# EAGLE schematic EEZ DIB MCU r2B1 (EAGLE 7.2.0)
Assembly variants: Farnell, TME

## Sheet 1 of 5: I/O connectors, Encoder, user SW
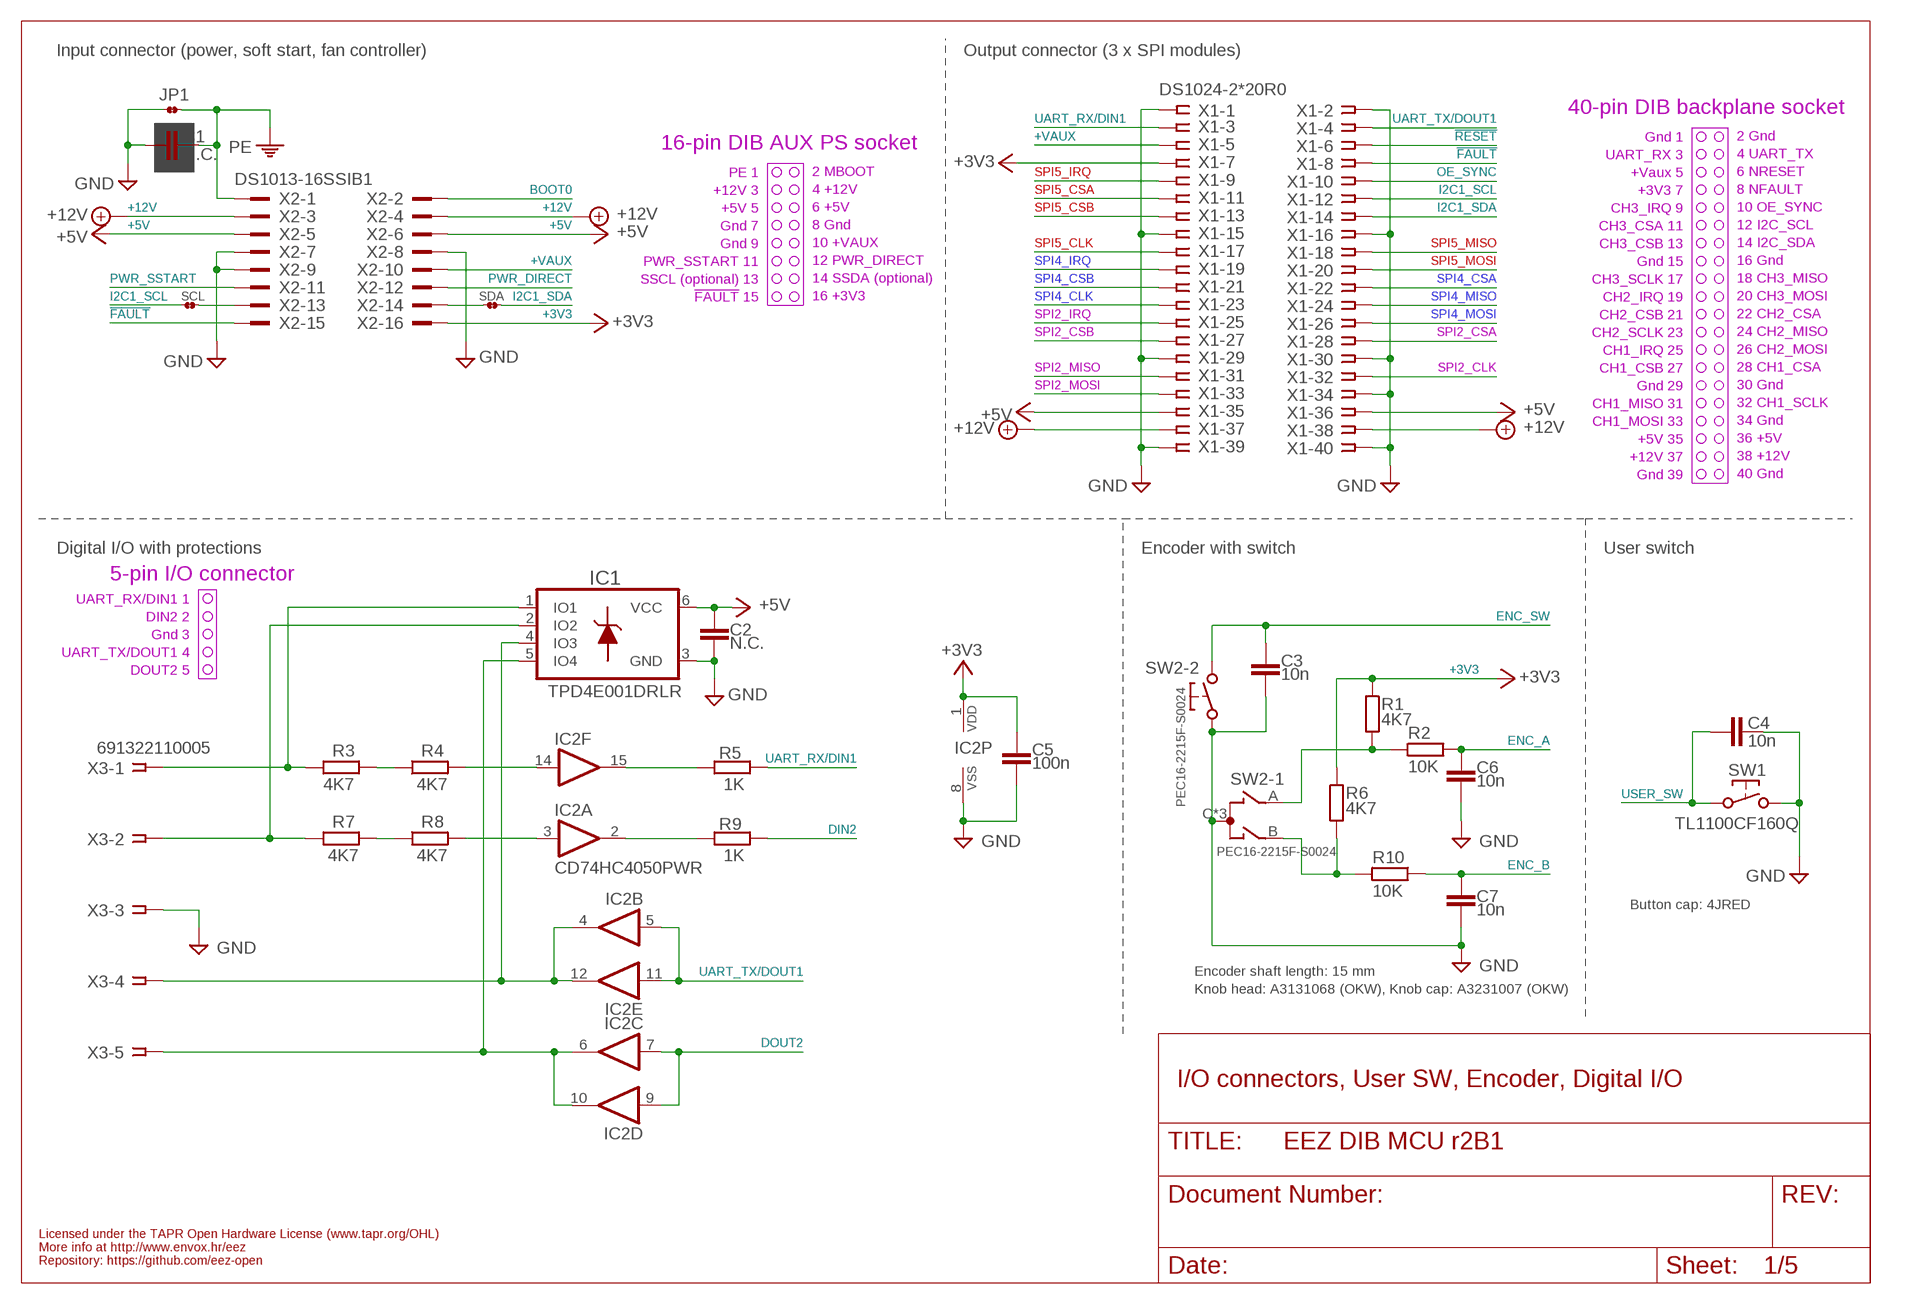
[diagram p0: schematic, sheet 1]

### Parts
C1  N.C.  C-EUC0805  [C0805]
C2  N.C.  C-EUC0603  [C0603]
C3  10n  C-EUC0805  [C0805]
C4  10n  C-EUC0805  [C0805]
C5  100n  C-EUC0603  [C0603]
C6  10n  C-EUC0805  [C0805]
C7  10n  C-EUC0805  [C0805]
IC1  TPD4E001DRLR  TPD4E001-DRL  [DRL6]
IC2  CD74HC4050PWR  [PW16]
JP1  JP2-NOCUT  [JP2-NOCUT]
R1  4K7  R-EU_R0805  [R0805]
R2  10K  R-EU_R0805  [R0805]
R3  4K7  R-EU_R0805  [R0805]
R4  4K7  R-EU_R0805  [R0805]
R5  1K  R-EU_R0805  [R0805]
R6  4K7  R-EU_R0805  [R0805]
R7  4K7  R-EU_R0805  [R0805]
R8  4K7  R-EU_R0805  [R0805]
R9  1K  R-EU_R0805  [R0805]
R10  10K  R-EU_R0805  [R0805]
SCL  JP2-NOCUT  [JP2-NOCUT]
SDA  JP2-NOCUT  [JP2-NOCUT]
SW1  TL1100CF160Q  TL1100C  [TL1100C]
SW2  PEC16-2215F-S0024  ENCODER_SW-PEC16  [PEC16-2215F]
X1  DS1024-2*20R0  ZL263-40DG  [ZL263-40DG]
X2  DS1013-16SSIB1  IDC-16PIN  [IDC-16PIN]
X3  691322110005  MC1,5/5-G-3,5  [MC1,5/5-G-3,5]

### Nets
!FAULT: X1.8 X2.15 ; also sheet 2
!RESET: X1.6 ; also sheet 2,3,4,5
+3V3: C5.1 IC2.1(P:VDD) R1.1 R6.1 X1.7 X2.16 ; also sheet 2,3,4,5
+5V: C2.1 IC1.6(VCC) X1.35 X1.36 X2.5 X2.6 ; also sheet 2,4
+12V: X1.37 X1.38 X2.3 X2.4
+VAUX: X1.5 X2.10 ; also sheet 2
BOOT0: X2.2 ; also sheet 2
DIN2: R9.2 ; also sheet 2
DOUT2: IC2.7(C:I) IC2.9(D:I) ; also sheet 2
ENC_A: C6.2 R2.1 ; also sheet 2
ENC_B: C7.1 R10.1 ; also sheet 2
ENC_SW: C3.2 SW2.E ; also sheet 2
EOUT_A: R6.2 R10.2 SW2.B(-1:B)
EOUT_B: R1.2 R2.2 SW2.A(-1:A)
GND [gnd]: C1.2 C2.2 C3.1 C4.1 C5.2 C6.1 C7.2 IC1.3(GND) IC2.8(P:VSS) JP1.1 SW1.2 SW2.C(-1:C) SW2.D SW2.GND1(-1:C) SW2.GND2(-1:C) X1.1 X1.2 X1.15 X1.16 X1.29 X1.30 X1.34 X1.39 X1.40 X2.7 X2.8 X2.9 X3.3 ; also sheet 2,3,4,5
I2C1_SCL: SCL.1 X1.12 ; also sheet 2,3,4
I2C1_SDA: SDA.2 X1.14 ; also sheet 2,3,4
N$6: IC1.1(IO1) R3.1 X3.1
N$7: SCL.2 X2.13
N$13: SDA.1 X2.14
N$14: IC1.2(IO2) R7.1 X3.2
N$38: R7.2 R8.1
N$41: R3.2 R4.1
N$42: IC2.15(F:O) R5.1
N$43: IC2.2(A:O) R9.1
N$46: IC2.14(F:I) R4.2
N$47: IC2.3(A:I) R8.2
N$48: IC1.4(IO3) IC2.4(B:O) IC2.12(E:O) X3.4
N$49: IC1.5(IO4) IC2.6(C:O) IC2.10(D:O) X3.5
OE_SYNC: X1.10 ; also sheet 2
PE: C1.1 JP1.2 X2.1 ; also sheet 4,5
PWR_DIRECT: X2.12 ; also sheet 2
PWR_SSTART: X2.11 ; also sheet 2
SPI2_CLK: X1.32 ; also sheet 2
SPI2_CSA: X1.28 ; also sheet 2
SPI2_CSB: X1.27 ; also sheet 2
SPI2_IRQ: X1.25 ; also sheet 2
SPI2_MISO: X1.31 ; also sheet 2
SPI2_MOSI: X1.33 ; also sheet 2
SPI4_CLK: X1.23 ; also sheet 2
SPI4_CSA: X1.22 ; also sheet 2
SPI4_CSB: X1.21 ; also sheet 2
SPI4_IRQ: X1.19 ; also sheet 2
SPI4_MISO: X1.24 ; also sheet 2
SPI4_MOSI: X1.26 ; also sheet 2
SPI5_CLK: X1.17 ; also sheet 2
SPI5_CSA: X1.11 ; also sheet 2
SPI5_CSB: X1.13 ; also sheet 2
SPI5_IRQ: X1.9 ; also sheet 2
SPI5_MISO: X1.18 ; also sheet 2
SPI5_MOSI: X1.20 ; also sheet 2
UART_RX/DIN1: R5.2 X1.3 ; also sheet 2
UART_TX/DOUT1: IC2.5(B:I) IC2.11(E:I) X1.4 ; also sheet 2
USER_SW: C4.2 SW1.1 ; also sheet 2

### Notes on the sheet
- Input connector (power, soft start, fan controller) | Output connector (3 x SPI modules)
- 40-pin DIB backplane socket
- Gnd 1
- 2 Gnd
- 16-pin DIB AUX PS socket | UART_RX 3
- 4 UART_TX
- PE 1 | +Vaux 5
- 2 MBOOT | 6 NRESET
- +12V 3 | +3V3 7
- 4 +12V | 8 NFAULT
- +5V 5 | CH3_IRQ 9
- 6 +5V | 10 OE_SYNC
- Gnd 7 | CH3_CSA 11
- 8 Gnd | 12 I2C_SCL
- Gnd 9 | CH3_CSB 13
- 10 +VAUX | 14 I2C_SDA
- PWR_SSTART 11 | Gnd 15
- 12 PWR_DIRECT | 16 Gnd
- SSCL (optional) 13 | CH3_SCLK 17
- 14 SSDA (optional) | 18 CH3_MISO
- !FAULT! 15 | CH2_IRQ 19
- 16 +3V3 | 20 CH3_MOSI
- CH2_CSB 21
- 22 CH2_CSA
- CH2_SCLK 23
- 24 CH2_MISO
- CH1_IRQ 25
- 26 CH2_MOSI
- CH1_CSB 27
- 28 CH1_CSA
- Gnd 29
- 30 Gnd
- CH1_MISO 31
- 32 CH1_SCLK
- CH1_MOSI 33
- 34 Gnd
- +5V 35
- 36 +5V
- +12V 37
- 38 +12V
- Gnd 39
- 40 Gnd
- Digital I/O with protections | Encoder with switch | User switch
- 5-pin I/O connector
- UART_RX/DIN1 1
- DIN2 2
- Gnd 3
- UART_TX/DOUT1 4
- DOUT2 5
- Button cap: 4JRED
- Encoder shaft length: 15 mm
- Knob head: A3131068 (OKW), Knob cap: A3231007 (OKW)
- I/O connectors, User SW, Encoder, Digital I/O
- Licensed under the TAPR Open Hardware License (www.tapr.org/OHL)
- More info at http://www.envox.hr/eez
- Repository: https://github.com/eez-open

## Sheet 2 of 5: STM32F7 MCU
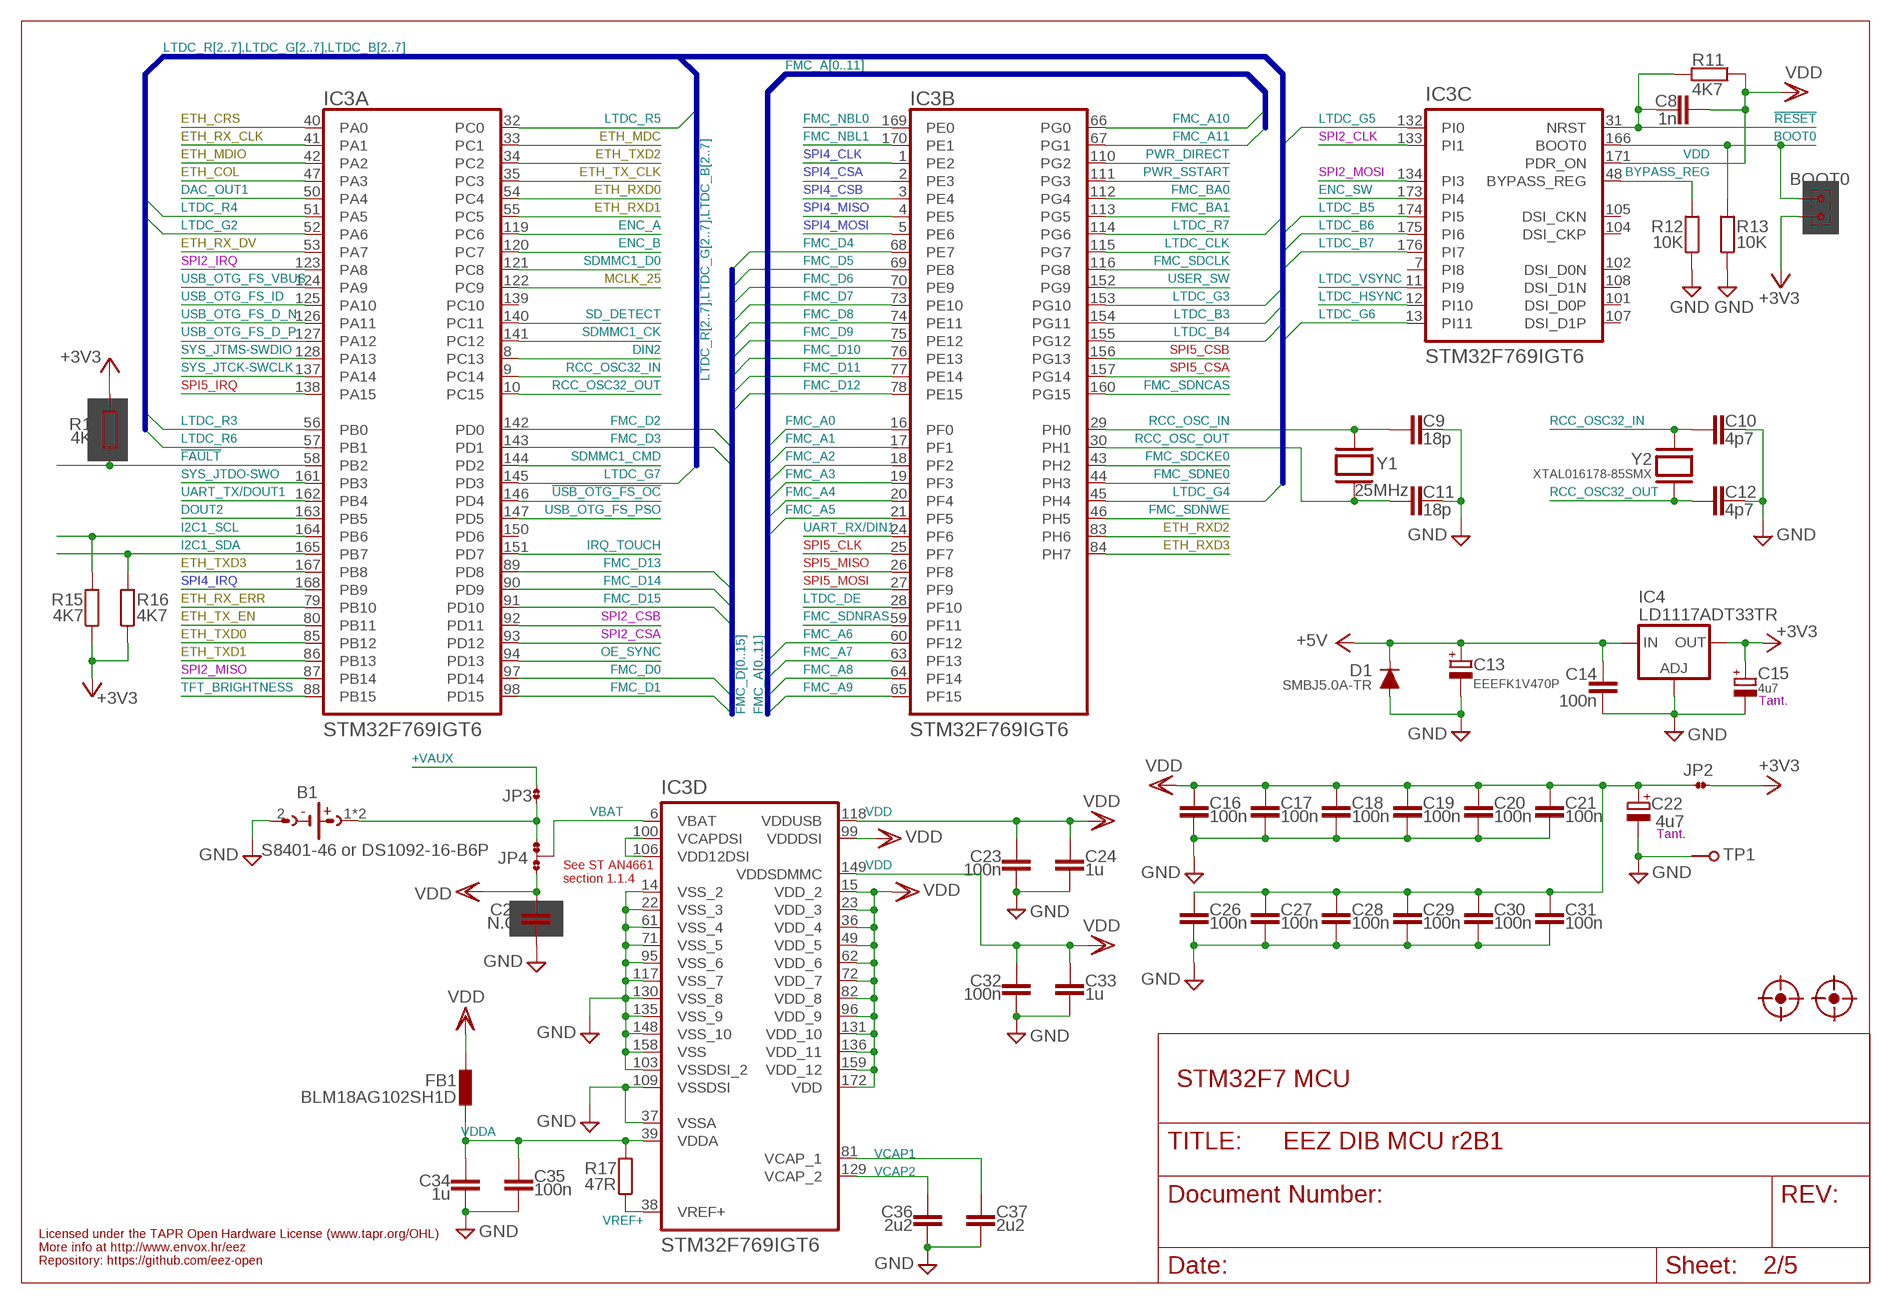
[diagram p1: schematic, sheet 2]

### Parts
B1  S8401-46 or DS1092-16-B6P  CELL_BATTERYVERT  [S8401-46]
BOOT0  JUMPER-2PIN-2MM  [2MM-2]
C8  1n  C-EUC0805  [C0805]
C9  18p  C-EUC0603  [C0603]
C10  4p7  C-EUC0603  [C0603]
C11  18p  C-EUC0603  [C0603]
C12  4p7  C-EUC0603  [C0603]
C13  EEEFK1V470P  ECAPPANASONIC_H  [CAPAE660X610N]
C14  100n  C-EUC0603  [C0603]
C15  4u7  ECAP1206  [EC1206]
C16  100n  C-EUC0603  [C0603]
C17  100n  C-EUC0603  [C0603]
C18  100n  C-EUC0603  [C0603]
C19  100n  C-EUC0603  [C0603]
C20  100n  C-EUC0603  [C0603]
C21  100n  C-EUC0603  [C0603]
C22  4u7  ECAP1206  [EC1206]
C23  100n  C-EUC0603  [C0603]
C24  1u  C-EUC0805  [C0805]
C25  N.C.  C-EUC0603  [C0603]
C26  100n  C-EUC0603  [C0603]
C27  100n  C-EUC0603  [C0603]
C28  100n  C-EUC0603  [C0603]
C29  100n  C-EUC0603  [C0603]
C30  100n  C-EUC0603  [C0603]
C31  100n  C-EUC0603  [C0603]
C32  100n  C-EUC0603  [C0603]
C33  1u  C-EUC0805  [C0805]
C34  1u  C-EUC0805  [C0805]
C35  100n  C-EUC0603  [C0603]
C36  2u2  C-EUC0805  [C0805]
C37  2u2  C-EUC0805  [C0805]
D1  SMBJ5.0A-TR  DIODEDO214AA  [DO214AA]
FB1  BLM18AG102SH1D  FERRITE_BEAD0603  [BEAD0603]
FM1  FIDUCIAL  [FIDUCIAL]
FM2  FIDUCIAL  [FIDUCIAL]
IC3  STM32F769IGT6  STM32F769IXT  [LQFP-176_24X24MM]
IC4  LD1117ADT33TR  LD117ADT33TR  [DPACK]
JP2  JP2-NOCUT  [JP2-NOCUT]
JP3  JP2-CUT  [JP2-CUT]
JP4  JP3-CUT  [JP3-CUT]
R11  4K7  R-EU_R0805  [R0805]
R12  10K  R-EU_R0805  [R0805]
R13  10K  R-EU_R0805  [R0805]
R14  4K7  R-EU_R0805  [R0805]
R15  4K7  R-EU_R0805  [R0805]
R16  4K7  R-EU_R0805  [R0805]
R17  47R  R-EU_R0805  [R0805]
TP1  PCB_TEST_TABSHIELD  [PCB_SHIELD_TAB]
Y1  25MHz  XTALSMD  [HC-49/4H]
Y2  XTAL016178-85SMX  XTAL85SMX  [85SMX]

### Nets
!FAULT: IC3.58(A:PB2) R14.2 ; also sheet 1
!RESET: C8.1 IC3.31(C:NRST) R11.2 ; also sheet 1,3,4,5
!USB_OTG_FS_OC: IC3.146(A:PD4) ; also sheet 4
+3V3: BOOT0.2 C15.+ IC4.4(OUT) JP2.2 R14.1 R15.1 R16.1 ; also sheet 1,3,4,5
+5V: C13.1(+) C14.1 D1.C IC4.3(IN) ; also sheet 1,4
+VAUX: JP3.2 ; also sheet 1
BOOT0: BOOT0.1 IC3.166(C:BOOT0) R13.2 ; also sheet 1
BYPASS_REG: IC3.48(C:BYPASS_REG) R12.2
DAC_OUT1: IC3.50(A:PA4) ; also sheet 4
DIN2: IC3.8(A:PC13) ; also sheet 1
DOUT2: IC3.163(A:PB5) ; also sheet 1
ENC_A: IC3.119(A:PC6) ; also sheet 1
ENC_B: IC3.120(A:PC7) ; also sheet 1
ENC_SW: IC3.173(C:PI4) ; also sheet 1
ETH_COL: IC3.47(A:PA3) ; also sheet 5
ETH_CRS: IC3.40(A:PA0) ; also sheet 5
ETH_MDC: IC3.33(A:PC1) ; also sheet 5
ETH_MDIO: IC3.42(A:PA2) ; also sheet 5
ETH_RX_CLK: IC3.41(A:PA1) ; also sheet 5
ETH_RX_DV: IC3.53(A:PA7) ; also sheet 5
ETH_RX_ERR: IC3.79(A:PB10) ; also sheet 5
ETH_RXD0: IC3.54(A:PC4) ; also sheet 5
ETH_RXD1: IC3.55(A:PC5) ; also sheet 5
ETH_RXD2: IC3.83(B:PH6) ; also sheet 5
ETH_RXD3: IC3.84(B:PH7) ; also sheet 5
ETH_TX_CLK: IC3.35(A:PC3) ; also sheet 5
ETH_TX_EN: IC3.80(A:PB11) ; also sheet 5
ETH_TXD0: IC3.85(A:PB12) ; also sheet 5
ETH_TXD1: IC3.86(A:PB13) ; also sheet 5
ETH_TXD2: IC3.34(A:PC2) ; also sheet 5
ETH_TXD3: IC3.167(A:PB8) ; also sheet 5
FMC_A0: IC3.16(B:PF0) ; also sheet 3
FMC_A1: IC3.17(B:PF1) ; also sheet 3
FMC_A2: IC3.18(B:PF2) ; also sheet 3
FMC_A3: IC3.19(B:PF3) ; also sheet 3
FMC_A4: IC3.20(B:PF4) ; also sheet 3
FMC_A5: IC3.21(B:PF5) ; also sheet 3
FMC_A6: IC3.60(B:PF12) ; also sheet 3
FMC_A7: IC3.63(B:PF13) ; also sheet 3
FMC_A8: IC3.64(B:PF14) ; also sheet 3
FMC_A9: IC3.65(B:PF15) ; also sheet 3
FMC_A10: IC3.66(B:PG0) ; also sheet 3
FMC_A11: IC3.67(B:PG1) ; also sheet 3
FMC_BA0: IC3.112(B:PG4) ; also sheet 3
FMC_BA1: IC3.113(B:PG5) ; also sheet 3
FMC_D0: IC3.97(A:PD14) ; also sheet 3
FMC_D1: IC3.98(A:PD15) ; also sheet 3
FMC_D2: IC3.142(A:PD0) ; also sheet 3
FMC_D3: IC3.143(A:PD1) ; also sheet 3
FMC_D4: IC3.68(B:PE7) ; also sheet 3
FMC_D5: IC3.69(B:PE8) ; also sheet 3
FMC_D6: IC3.70(B:PE9) ; also sheet 3
FMC_D7: IC3.73(B:PE10) ; also sheet 3
FMC_D8: IC3.74(B:PE11) ; also sheet 3
FMC_D9: IC3.75(B:PE12) ; also sheet 3
FMC_D10: IC3.76(B:PE13) ; also sheet 3
FMC_D11: IC3.77(B:PE14) ; also sheet 3
FMC_D12: IC3.78(B:PE15) ; also sheet 3
FMC_D13: IC3.89(A:PD8) ; also sheet 3
FMC_D14: IC3.90(A:PD9) ; also sheet 3
FMC_D15: IC3.91(A:PD10) ; also sheet 3
FMC_NBL0: IC3.169(B:PE0) ; also sheet 3
FMC_NBL1: IC3.170(B:PE1) ; also sheet 3
FMC_SDCKE0: IC3.43(B:PH2) ; also sheet 3
FMC_SDCLK: IC3.116(B:PG8) ; also sheet 3
FMC_SDNCAS: IC3.160(B:PG15) ; also sheet 3
FMC_SDNE0: IC3.44(B:PH3) ; also sheet 3
FMC_SDNRAS: IC3.59(B:PF11) ; also sheet 3
FMC_SDNWE: IC3.46(B:PH5) ; also sheet 3
GND [gnd]: B1.2(-) C9.1 C10.2 C11.1 C12.2 C13.2(-) C14.2 C15.- C16.2 C17.2 C18.2 C19.2 C20.2 C21.2 C22.- C23.2 C24.2 C25.2 C26.2 C27.2 C28.2 C29.2 C30.2 C31.2 C32.2 C33.2 C34.2 C35.2 C36.2 C37.2 D1.A IC3.14(D:VSS_2) IC3.22(D:VSS_3) IC3.37(D:VSSA) IC3.61(D:VSS_4) IC3.71(D:VSS_5) IC3.95(D:VSS_6) IC3.103(D:VSSDSI_2) IC3.109(D:VSSDSI) IC3.117(D:VSS_7) IC3.130(D:VSS_8) IC3.135(D:VSS_9) IC3.148(D:VSS_10) IC3.158(D:VSS) IC4.1(ADJ) R12.1 R13.1 TP1.1 ; also sheet 1,3,4,5
I2C1_SCL: IC3.164(A:PB6) R15.2 ; also sheet 1,3,4
I2C1_SDA: IC3.165(A:PB7) R16.2 ; also sheet 1,3,4
IRQ_TOUCH: IC3.151(A:PD7) ; also sheet 4
LTDC_B3: IC3.154(B:PG11) ; also sheet 4
LTDC_B4: IC3.155(B:PG12) ; also sheet 4
LTDC_B5: IC3.174(C:PI5) ; also sheet 4
LTDC_B6: IC3.175(C:PI6) ; also sheet 4
LTDC_B7: IC3.176(C:PI7) ; also sheet 4
LTDC_CLK: IC3.115(B:PG7) ; also sheet 4
LTDC_DE: IC3.28(B:PF10) ; also sheet 4
LTDC_G2: IC3.52(A:PA6) ; also sheet 4
LTDC_G3: IC3.153(B:PG10) ; also sheet 4
LTDC_G4: IC3.45(B:PH4) ; also sheet 4
LTDC_G5: IC3.132(C:PI0) ; also sheet 4
LTDC_G6: IC3.13(C:PI11) ; also sheet 4
LTDC_G7: IC3.145(A:PD3) ; also sheet 4
LTDC_HSYNC: IC3.12(C:PI10) ; also sheet 4
LTDC_R3: IC3.56(A:PB0) ; also sheet 4
LTDC_R4: IC3.51(A:PA5) ; also sheet 4
LTDC_R5: IC3.32(A:PC0) ; also sheet 4
LTDC_R6: IC3.57(A:PB1) ; also sheet 4
LTDC_R7: IC3.114(B:PG6) ; also sheet 4
LTDC_VSYNC: IC3.11(C:PI9) ; also sheet 4
MCLK_25: IC3.122(A:PC9) ; also sheet 5
N$20: B1.1(+) B1.3(+) JP3.1 JP4.NC
N$178: IC3.100(D:VCAPDSI) IC3.106(D:VDD12DSI)
OE_SYNC: IC3.94(A:PD13) ; also sheet 1
PWR_DIRECT: IC3.110(B:PG2) ; also sheet 1
PWR_SSTART: IC3.111(B:PG3) ; also sheet 1
RCC_OSC32_IN: C10.1 IC3.9(A:PC14) Y2.1
RCC_OSC32_OUT: C12.1 IC3.10(A:PC15) Y2.4
RCC_OSC_IN: C9.2 IC3.29(B:PH0) Y1.2
RCC_OSC_OUT: C11.2 IC3.30(B:PH1) Y1.1
SD_DETECT: IC3.140(A:PC11) ; also sheet 3
SDMMC1_CK: IC3.141(A:PC12) ; also sheet 3
SDMMC1_CMD: IC3.144(A:PD2) ; also sheet 3
SDMMC1_D0: IC3.121(A:PC8) ; also sheet 3
SPI2_CLK: IC3.133(C:PI1) ; also sheet 1
SPI2_CSA: IC3.93(A:PD12) ; also sheet 1
SPI2_CSB: IC3.92(A:PD11) ; also sheet 1
SPI2_IRQ: IC3.123(A:PA8) ; also sheet 1
SPI2_MISO: IC3.87(A:PB14) ; also sheet 1
SPI2_MOSI: IC3.134(C:PI3) ; also sheet 1
SPI4_CLK: IC3.1(B:PE2) ; also sheet 1
SPI4_CSA: IC3.2(B:PE3) ; also sheet 1
SPI4_CSB: IC3.3(B:PE4) ; also sheet 1
SPI4_IRQ: IC3.168(A:PB9) ; also sheet 1
SPI4_MISO: IC3.4(B:PE5) ; also sheet 1
SPI4_MOSI: IC3.5(B:PE6) ; also sheet 1
SPI5_CLK: IC3.25(B:PF7) ; also sheet 1
SPI5_CSA: IC3.157(B:PG14) ; also sheet 1
SPI5_CSB: IC3.156(B:PG13) ; also sheet 1
SPI5_IRQ: IC3.138(A:PA15) ; also sheet 1
SPI5_MISO: IC3.26(B:PF8) ; also sheet 1
SPI5_MOSI: IC3.27(B:PF9) ; also sheet 1
SYS_JTCK-SWCLK: IC3.137(A:PA14) ; also sheet 3
SYS_JTDO-SWO: IC3.161(A:PB3) ; also sheet 3
SYS_JTMS-SWDIO: IC3.128(A:PA13) ; also sheet 3
TFT_BRIGHTNESS: IC3.88(A:PB15) ; also sheet 4
UART_RX/DIN1: IC3.24(B:PF6) ; also sheet 1
UART_TX/DOUT1: IC3.162(A:PB4) ; also sheet 1
USB_OTG_FS_D_N [diff]: IC3.126(A:PA11) ; also sheet 4
USB_OTG_FS_D_P [diff]: IC3.127(A:PA12) ; also sheet 4
USB_OTG_FS_ID: IC3.125(A:PA10) ; also sheet 4
USB_OTG_FS_PSO: IC3.147(A:PD5) ; also sheet 4
USB_OTG_FS_VBUS: IC3.124(A:PA9) ; also sheet 4
USER_SW: IC3.152(B:PG9) ; also sheet 1
VBAT: IC3.6(D:VBAT) JP4.COM
VCAP1: C37.1 IC3.81(D:VCAP_1)
VCAP2: C36.1 IC3.129(D:VCAP_2)
VDD: C8.2 C16.1 C17.1 C18.1 C19.1 C20.1 C21.1 C22.+ C23.1 C24.1 C25.1 C26.1 C27.1 C28.1 C29.1 C30.1 C31.1 C32.1 C33.1 FB1.P$1 IC3.15(D:VDD_2) IC3.23(D:VDD_3) IC3.36(D:VDD_4) IC3.49(D:VDD_5) IC3.62(D:VDD_6) IC3.72(D:VDD_7) IC3.82(D:VDD_8) IC3.96(D:VDD_9) IC3.99(D:VDDDSI) IC3.118(D:VDDUSB) IC3.131(D:VDD_10) IC3.136(D:VDD_11) IC3.149(D:VDDSDMMC) IC3.159(D:VDD_12) IC3.171(C:PDR_ON) IC3.172(D:VDD) JP2.1 JP4.NO R11.1
VDDA: C34.1 C35.1 FB1.P$2 IC3.39(D:VDDA) R17.2
VREF+: IC3.38(D:VREF+) R17.1
Unconnected: IC3.7(C:PI8) IC3.101(C:DSI_D0P) IC3.102(C:DSI_D0N) IC3.104(C:DSI_CKP) IC3.105(C:DSI_CKN) IC3.107(C:DSI_D1P) IC3.108(C:DSI_D1N) IC3.139(A:PC10) IC3.150(A:PD6)

### Buses
FMC_A[0..11]
LTDC_R[2..7],LTDC_G[2..7],LTDC_B[2..7]
FMC_D[0..15]

### Notes on the sheet
- Tant.
- Tant.
- See ST AN4661
  section 1.1.4
- STM32F7 MCU
- Licensed under the TAPR Open Hardware License (www.tapr.org/OHL)
- More info at http://www.envox.hr/eez
- Repository: https://github.com/eez-open

## Sheet 3 of 5: SDRAM, JTAG, SD card, EEPROM
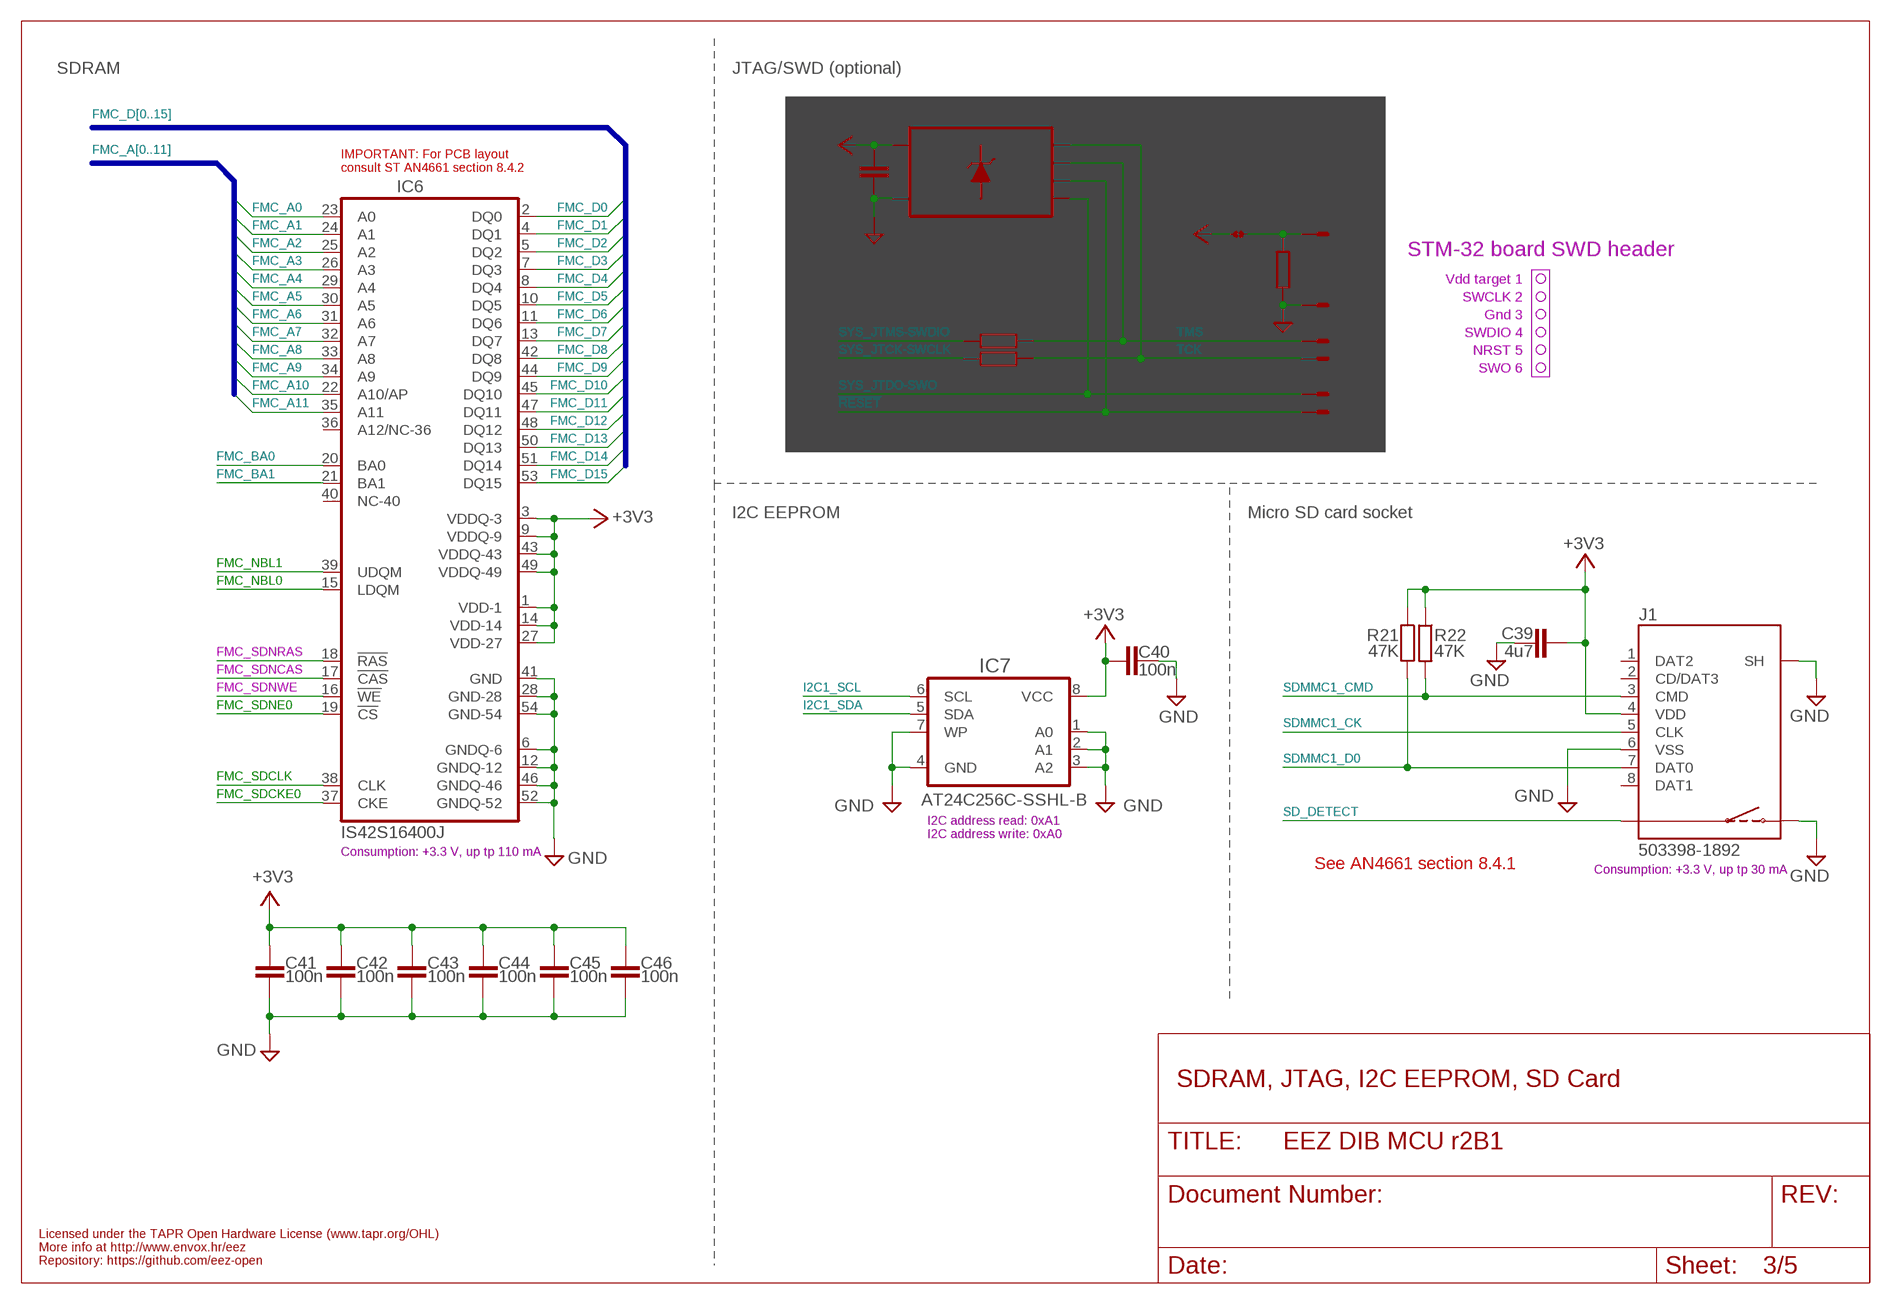
[diagram p2: schematic, sheet 3]

### Parts
C38  N.C.  C-EUC0603  [C0603]
C39  4u7  C-EUC1206  [C1206]
C40  100n  C-EUC0603  [C0603]
C41  100n  C-EUC0603  [C0603]
C42  100n  C-EUC0603  [C0603]
C43  100n  C-EUC0603  [C0603]
C44  100n  C-EUC0603  [C0603]
C45  100n  C-EUC0603  [C0603]
C46  100n  C-EUC0603  [C0603]
IC5  N.C.  TPD4E001-DRL  [DRL6]
IC6  IS42S16400J  IS42S16400  [TSOPII-54]
IC7  AT24C256C-SSHL-B  AT24CXXSOIC8  [SOIC127P600X173-8N]
J1  503398-1892  5033981892  [5033981892]
JP5  JP2-CUT  [JP2-CUT]
R18  N.C.  R-EU_R0805  [R0805]
R19  N.C.  R-EU_R0805  [R0805]
R20  N.C.  R-EU_R0805  [R0805]
R21  47K  R-EU_R0805  [R0805]
R22  47K  R-EU_R0805  [R0805]
X4  N.C.  22-23-2061  [22-23-2061]

### Nets
!RESET: IC5.4(IO3) X4.5 ; also sheet 1,2,4,5
+3V3: C38.1 C39.1 C40.2 C41.1 C42.1 C43.1 C44.1 C45.1 C46.1 IC5.6(VCC) IC6.1(VDD-1) IC6.3(VDDQ-3) IC6.9(VDDQ-9) IC6.14(VDD-14) IC6.27(VDD-27) IC6.43(VDDQ-43) IC6.49(VDDQ-49) IC7.8(VCC) J1.4(VDD) JP5.1 R21.1 R22.1 ; also sheet 1,2,4,5
FMC_A0: IC6.23(A0) ; also sheet 2
FMC_A1: IC6.24(A1) ; also sheet 2
FMC_A2: IC6.25(A2) ; also sheet 2
FMC_A3: IC6.26(A3) ; also sheet 2
FMC_A4: IC6.29(A4) ; also sheet 2
FMC_A5: IC6.30(A5) ; also sheet 2
FMC_A6: IC6.31(A6) ; also sheet 2
FMC_A7: IC6.32(A7) ; also sheet 2
FMC_A8: IC6.33(A8) ; also sheet 2
FMC_A9: IC6.34(A9) ; also sheet 2
FMC_A10: IC6.22(A10/AP) ; also sheet 2
FMC_A11: IC6.35(A11) ; also sheet 2
FMC_BA0: IC6.20(BA0) ; also sheet 2
FMC_BA1: IC6.21(BA1) ; also sheet 2
FMC_D0: IC6.2(DQ0) ; also sheet 2
FMC_D1: IC6.4(DQ1) ; also sheet 2
FMC_D2: IC6.5(DQ2) ; also sheet 2
FMC_D3: IC6.7(DQ3) ; also sheet 2
FMC_D4: IC6.8(DQ4) ; also sheet 2
FMC_D5: IC6.10(DQ5) ; also sheet 2
FMC_D6: IC6.11(DQ6) ; also sheet 2
FMC_D7: IC6.13(DQ7) ; also sheet 2
FMC_D8: IC6.42(DQ8) ; also sheet 2
FMC_D9: IC6.44(DQ9) ; also sheet 2
FMC_D10: IC6.45(DQ10) ; also sheet 2
FMC_D11: IC6.47(DQ11) ; also sheet 2
FMC_D12: IC6.48(DQ12) ; also sheet 2
FMC_D13: IC6.50(DQ13) ; also sheet 2
FMC_D14: IC6.51(DQ14) ; also sheet 2
FMC_D15: IC6.53(DQ15) ; also sheet 2
FMC_NBL0: IC6.15(LDQM) ; also sheet 2
FMC_NBL1: IC6.39(UDQM) ; also sheet 2
FMC_SDCKE0: IC6.37(CKE) ; also sheet 2
FMC_SDCLK: IC6.38(CLK) ; also sheet 2
FMC_SDNCAS: IC6.17(!CAS) ; also sheet 2
FMC_SDNE0: IC6.19(!CS) ; also sheet 2
FMC_SDNRAS: IC6.18(!RAS) ; also sheet 2
FMC_SDNWE: IC6.16(!WE) ; also sheet 2
GND [gnd]: C38.2 C39.2 C40.1 C41.2 C42.2 C43.2 C44.2 C45.2 C46.2 IC5.3(GND) IC6.6(GNDQ-6) IC6.12(GNDQ-12) IC6.28(GND-28) IC6.41(GND) IC6.46(GNDQ-46) IC6.52(GNDQ-52) IC6.54(GND-54) IC7.1(A0) IC7.2(A1) IC7.3(A2) IC7.4(GND) IC7.7(WP) J1.6(VSS) J1.S1(SH) J1.S2(SH) J1.S(SH) J1.SW2 R18.1 X4.3 ; also sheet 1,2,4,5
I2C1_SCL: IC7.6(SCL) ; also sheet 1,2,4
I2C1_SDA: IC7.5(SDA) ; also sheet 1,2,4
N$51: JP5.2 R18.2 X4.1
SD_DETECT: J1.SW1 ; also sheet 2
SDMMC1_CK: J1.5(CLK) ; also sheet 2
SDMMC1_CMD: J1.3(CMD) R22.2 ; also sheet 2
SDMMC1_D0: J1.7(DAT0) R21.2 ; also sheet 2
SYS_JTCK-SWCLK: R20.1 ; also sheet 2
SYS_JTDO-SWO: IC5.5(IO4) X4.6 ; also sheet 2
SYS_JTMS-SWDIO: R19.1 ; also sheet 2
TCK: IC5.1(IO1) R20.2 X4.2
TMS: IC5.2(IO2) R19.2 X4.4
Unconnected: IC6.36(A12/NC-36) IC6.40(NC-40) J1.1(DAT2) J1.2(CD/DAT3) J1.8(DAT1)

### Buses
FMC_A[0..11]
FMC_D[0..15]

### Notes on the sheet
- SDRAM | JTAG/SWD (optional)
- IMPORTANT: For PCB layout 
  consult ST AN4661 section 8.4.2
- STM-32 board SWD header
- Vdd target 1
- SWCLK 2
- Gnd 3
- SWDIO 4
- NRST 5
- SWO 6
- I2C EEPROM | Micro SD card socket
- I2C address read: 0xA1
- I2C address write: 0xA0
- Consumption: +3.3 V, up tp 110 mA
- See AN4661 section 8.4.1
- Consumption: +3.3 V, up tp 30 mA
- SDRAM, JTAG, I2C EEPROM, SD Card
- Licensed under the TAPR Open Hardware License (www.tapr.org/OHL)
- More info at http://www.envox.hr/eez
- Repository: https://github.com/eez-open

## Sheet 4 of 5: TFT LCD, Audio, USB
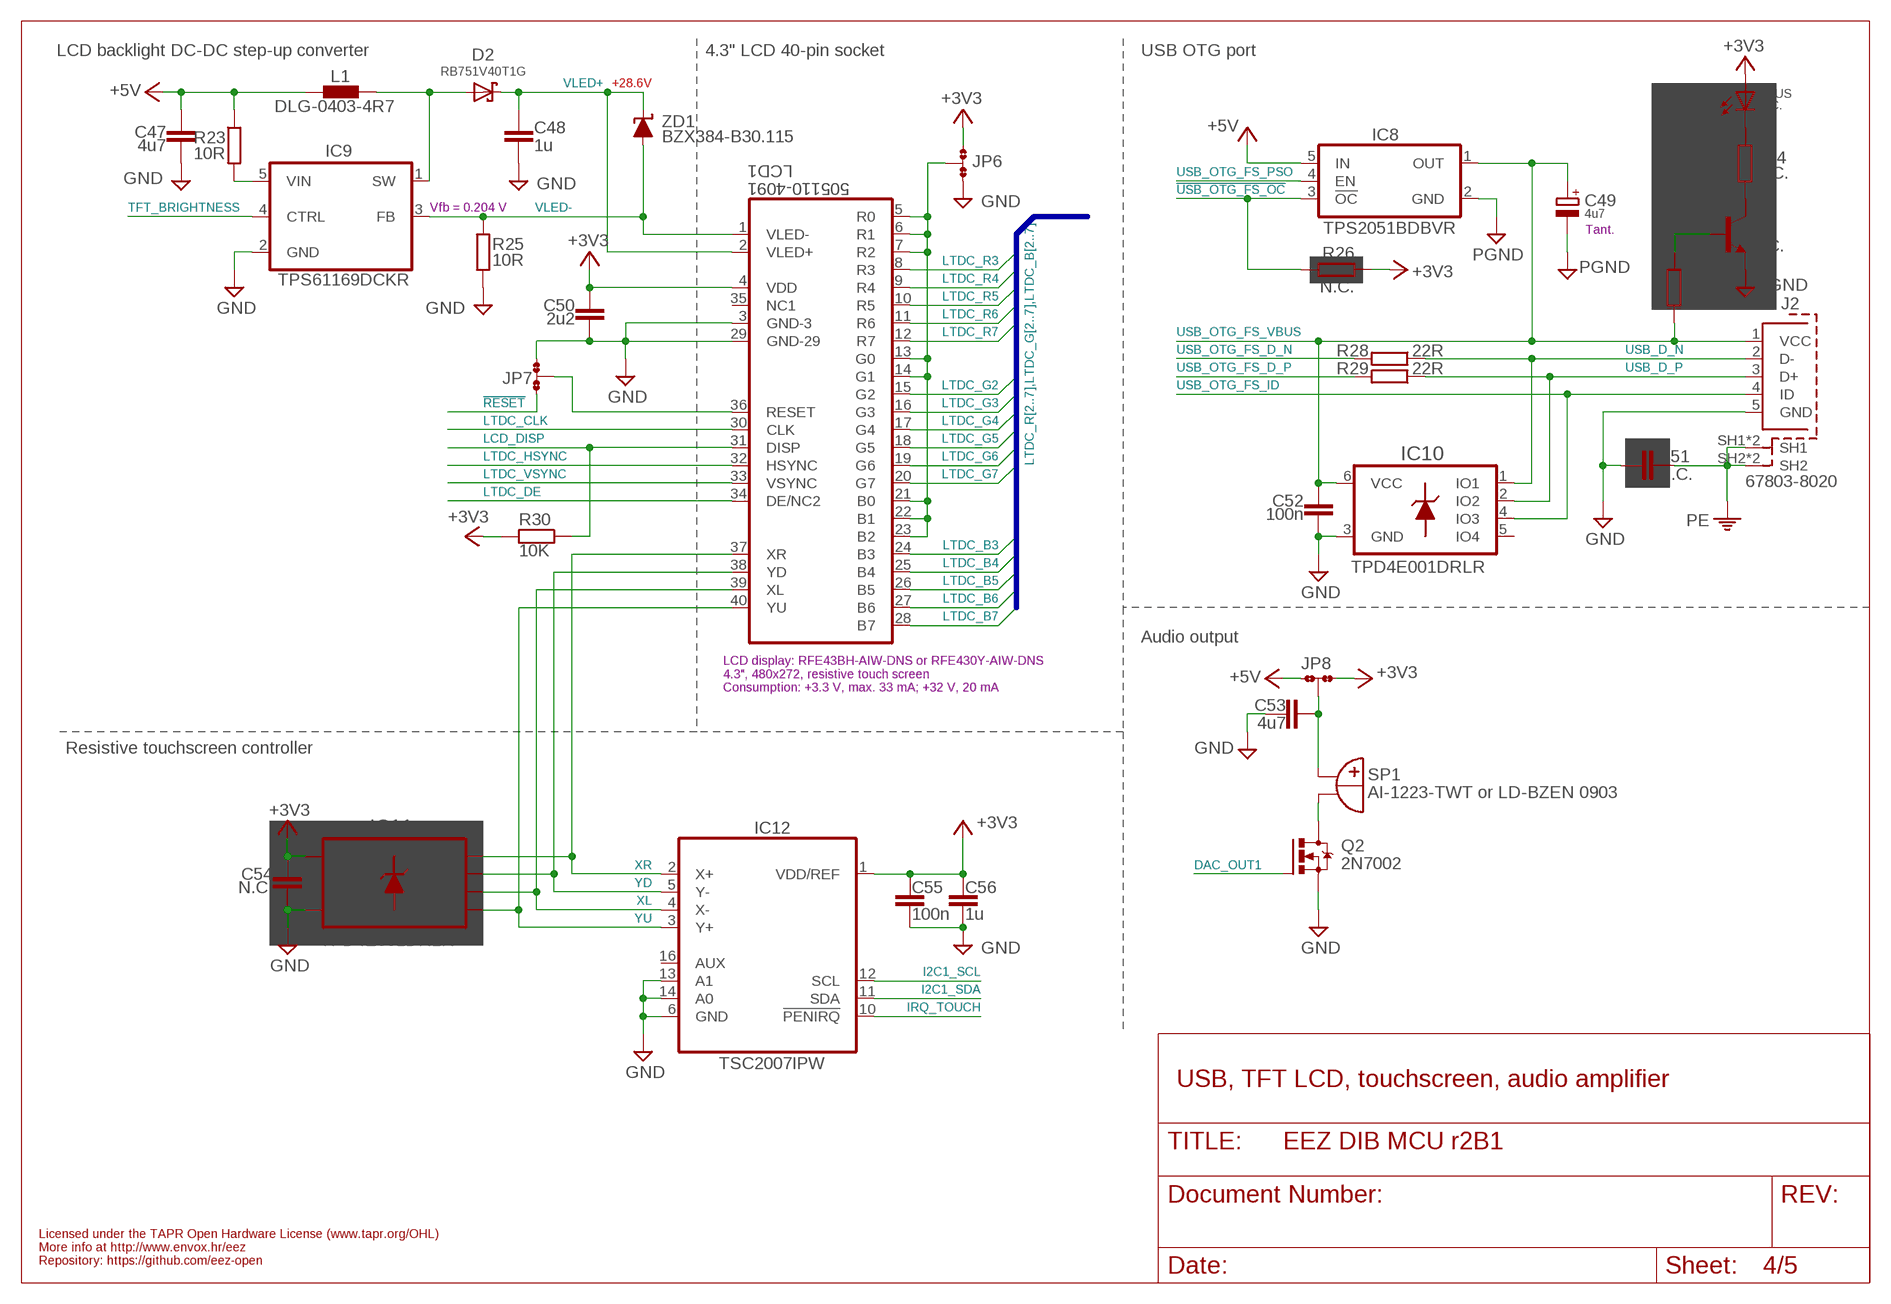
[diagram p3: schematic, sheet 4]

### Parts
C47  4u7  C-EUC1206  [C1206]
C48  1u  C-EUC0805  [C0805]
C49  4u7  ECAP1206  [EC1206]
C50  2u2  C-EUC0805  [C0805]
C51  N.C.  C-EUC0805  [C0805]
C52  100n  C-EUC0603  [C0603]
C53  4u7  C-EUC1206  [C1206]
C54  N.C.  C-EUC0603  [C0603]
C55  100n  C-EUC0603  [C0603]
C56  1u  C-EUC0805  [C0805]
D2  RB751V40T1G  SCHOTTKYSOD-323R  [SOD323-R]
IC8  TPS2051BDBVR  TPS2051B  [DBV5]
IC9  TPS61169DCKR  [DCK5]
IC10  TPD4E001DRLR  TPD4E001-DRL  [DRL6]
IC11  TPD4E001DRLR  TPD4E001-DRL  [DRL6]
IC12  TSC2007IPW  [PW(R-PDSO-G16)]
J2  67803-8020  678038020  [678038020]
JP6  JP3-CUT  [JP3-CUT]
JP7  JP3-CUT  [JP3-CUT]
JP8  JP3-CUT  [JP3-CUT]
L1  DLG-0403-4R7  DE0403  [DE0403]
LCD1  505110-4091  RFE430Y-AIW-DNS  [FPC_40]
Q1  N.C.  MMBT5551LT1-NPN-SOT23-BEC  [SOT23-BEC]
Q2  2N7002  [SOT103P240X110-3N]
R23  10R  R-EU_R0805  [R0805]
R24  N.C.  R-EU_R0805  [R0805]
R25  10R  R-EU_R0805  [R0805]
R26  N.C.  R-EU_R0805  [R0805]
R27  N.C.  R-EU_R0805  [R0805]
R28  22R  R-EU_R0805  [R0805]
R29  22R  R-EU_R0805  [R0805]
R30  10K  R-EU_R0805  [R0805]
SP1  AI-1223-TWT or LD-BZEN 0903  AI-1223-TWT-LDB0903  [AI-1223-TWT_COMBO]
VBUS  N.C.  LED0805  [LED_0805]
ZD1  BZX384-B30.115  ZENER-DIODESOD323  [SOD323-W]

### Nets
!RESET: JP7.NO ; also sheet 1,2,3,5
!USB_OTG_FS_OC: IC8.3(!OC) R26.1 ; also sheet 2
+3V3: C50.1 C54.2 C55.2 C56.2 IC11.6(VCC) IC12.1(VDD/REF) JP6.NO JP8.NC LCD1.4(VDD) R26.2 R30.2 VBUS.A ; also sheet 1,2,3,5
+5V: C47.1 IC8.5(IN) JP8.NO L1.1 R23.1 ; also sheet 1,2
DAC_OUT1: Q2.1(G) ; also sheet 2
GND [gnd]: C47.2 C48.2 C49.- C50.2 C51.2 C52.1 C53.1 C54.1 C55.1 C56.1 IC8.2(GND) IC9.2(GND) IC10.3(GND) IC11.3(GND) IC12.6(GND) IC12.13(A1) IC12.14(A0) J2.5(GND) JP6.NC JP7.NC LCD1.3(GND-3) LCD1.29(GND-29) Q1.E Q2.2(S) R25.2 ; supply symbol labelled PGND ; also sheet 1,2,3,5
I2C1_SCL: IC12.12(SCL) ; also sheet 1,2,3
I2C1_SDA: IC12.11(SDA) ; also sheet 1,2,3
IRQ_TOUCH: IC12.10(!PENIRQ) ; also sheet 2
LCD_DISP: LCD1.31(DISP) R30.1
LTDC_B3: LCD1.24(B3) ; also sheet 2
LTDC_B4: LCD1.25(B4) ; also sheet 2
LTDC_B5: LCD1.26(B5) ; also sheet 2
LTDC_B6: LCD1.27(B6) ; also sheet 2
LTDC_B7: LCD1.28(B7) ; also sheet 2
LTDC_CLK: LCD1.30(CLK) ; also sheet 2
LTDC_DE: LCD1.34(DE/NC2) ; also sheet 2
LTDC_G2: LCD1.15(G2) ; also sheet 2
LTDC_G3: LCD1.16(G3) ; also sheet 2
LTDC_G4: LCD1.17(G4) ; also sheet 2
LTDC_G5: LCD1.18(G5) ; also sheet 2
LTDC_G6: LCD1.19(G6) ; also sheet 2
LTDC_G7: LCD1.20(G7) ; also sheet 2
LTDC_HSYNC: LCD1.32(HSYNC) ; also sheet 2
LTDC_R3: LCD1.8(R3) ; also sheet 2
LTDC_R4: LCD1.9(R4) ; also sheet 2
LTDC_R5: LCD1.10(R5) ; also sheet 2
LTDC_R6: LCD1.11(R6) ; also sheet 2
LTDC_R7: LCD1.12(R7) ; also sheet 2
LTDC_VSYNC: LCD1.33(VSYNC) ; also sheet 2
N$2: R24.2 VBUS.C
N$4 [gnd]: JP6.COM LCD1.5(R0) LCD1.6(R1) LCD1.7(R2) LCD1.13(G0) LCD1.14(G1) LCD1.21(B0) LCD1.22(B1) LCD1.23(B2)
N$5: Q2.3(D) SP1.-B(-) SP1.-B.1(-)
N$16: Q1.C R24.1
N$19: Q1.B R27.2
N$24: JP7.COM LCD1.36(RESET)
N$30: IC9.5(VIN) R23.2
N$52: C53.2 JP8.COM SP1.+B(+) SP1.+B.1(+)
PE: C51.1 J2.SH1 J2.SH1.1(SH1) J2.SH2 J2.SH2.2(SH2) ; also sheet 1,5
SW_WLED: D2.A IC9.1(SW) L1.2
TFT_BRIGHTNESS: IC9.4(CTRL) ; also sheet 2
USB_D_N [diff]: IC10.1(IO1) J2.2(D-) R28.1
USB_D_P [diff]: IC10.2(IO2) J2.3(D+) R29.1
USB_OTG_FS_D_N [diff]: R28.2 ; also sheet 2
USB_OTG_FS_D_P [diff]: R29.2 ; also sheet 2
USB_OTG_FS_ID: IC10.4(IO3) J2.4(ID) ; also sheet 2
USB_OTG_FS_PSO: IC8.4(EN) ; also sheet 2
USB_OTG_FS_VBUS: C49.+ C52.2 IC8.1(OUT) IC10.6(VCC) J2.1(VCC) R27.1 ; also sheet 2
VLED+: C48.1 D2.C LCD1.2(VLED+) ZD1.C
VLED-: IC9.3(FB) LCD1.1(VLED-) R25.1 ZD1.A
XL: IC11.4(IO3) IC12.4(X-) LCD1.39(XL)
XR: IC11.1(IO1) IC12.2(X+) LCD1.37(XR)
YD: IC11.2(IO2) IC12.5(Y-) LCD1.38(YD)
YU: IC11.5(IO4) IC12.3(Y+) LCD1.40(YU)
Unconnected: IC10.5(IO4) IC12.16(AUX) LCD1.35(NC1)

### Buses
LTDC_R[2..7],LTDC_G[2..7],LTDC_B[2..7]

### Notes on the sheet
- LCD backlight DC-DC step-up converter | 4.3" LCD 40-pin socket | USB OTG port
- +28.6V
- Vfb = 0.204 V
- Tant.
- Audio output
- LCD display: RFE43BH-AIW-DNS or RFE430Y-AIW-DNS
  4.3", 480x272, resistive touch screen
- Consumption: +3.3 V, max. 33 mA; +32 V, 20 mA
- Resistive touchscreen controller
- USB, TFT LCD, touchscreen, audio amplifier
- Licensed under the TAPR Open Hardware License (www.tapr.org/OHL)
- More info at http://www.envox.hr/eez
- Repository: https://github.com/eez-open

## Sheet 5 of 5: Ethernet PHY
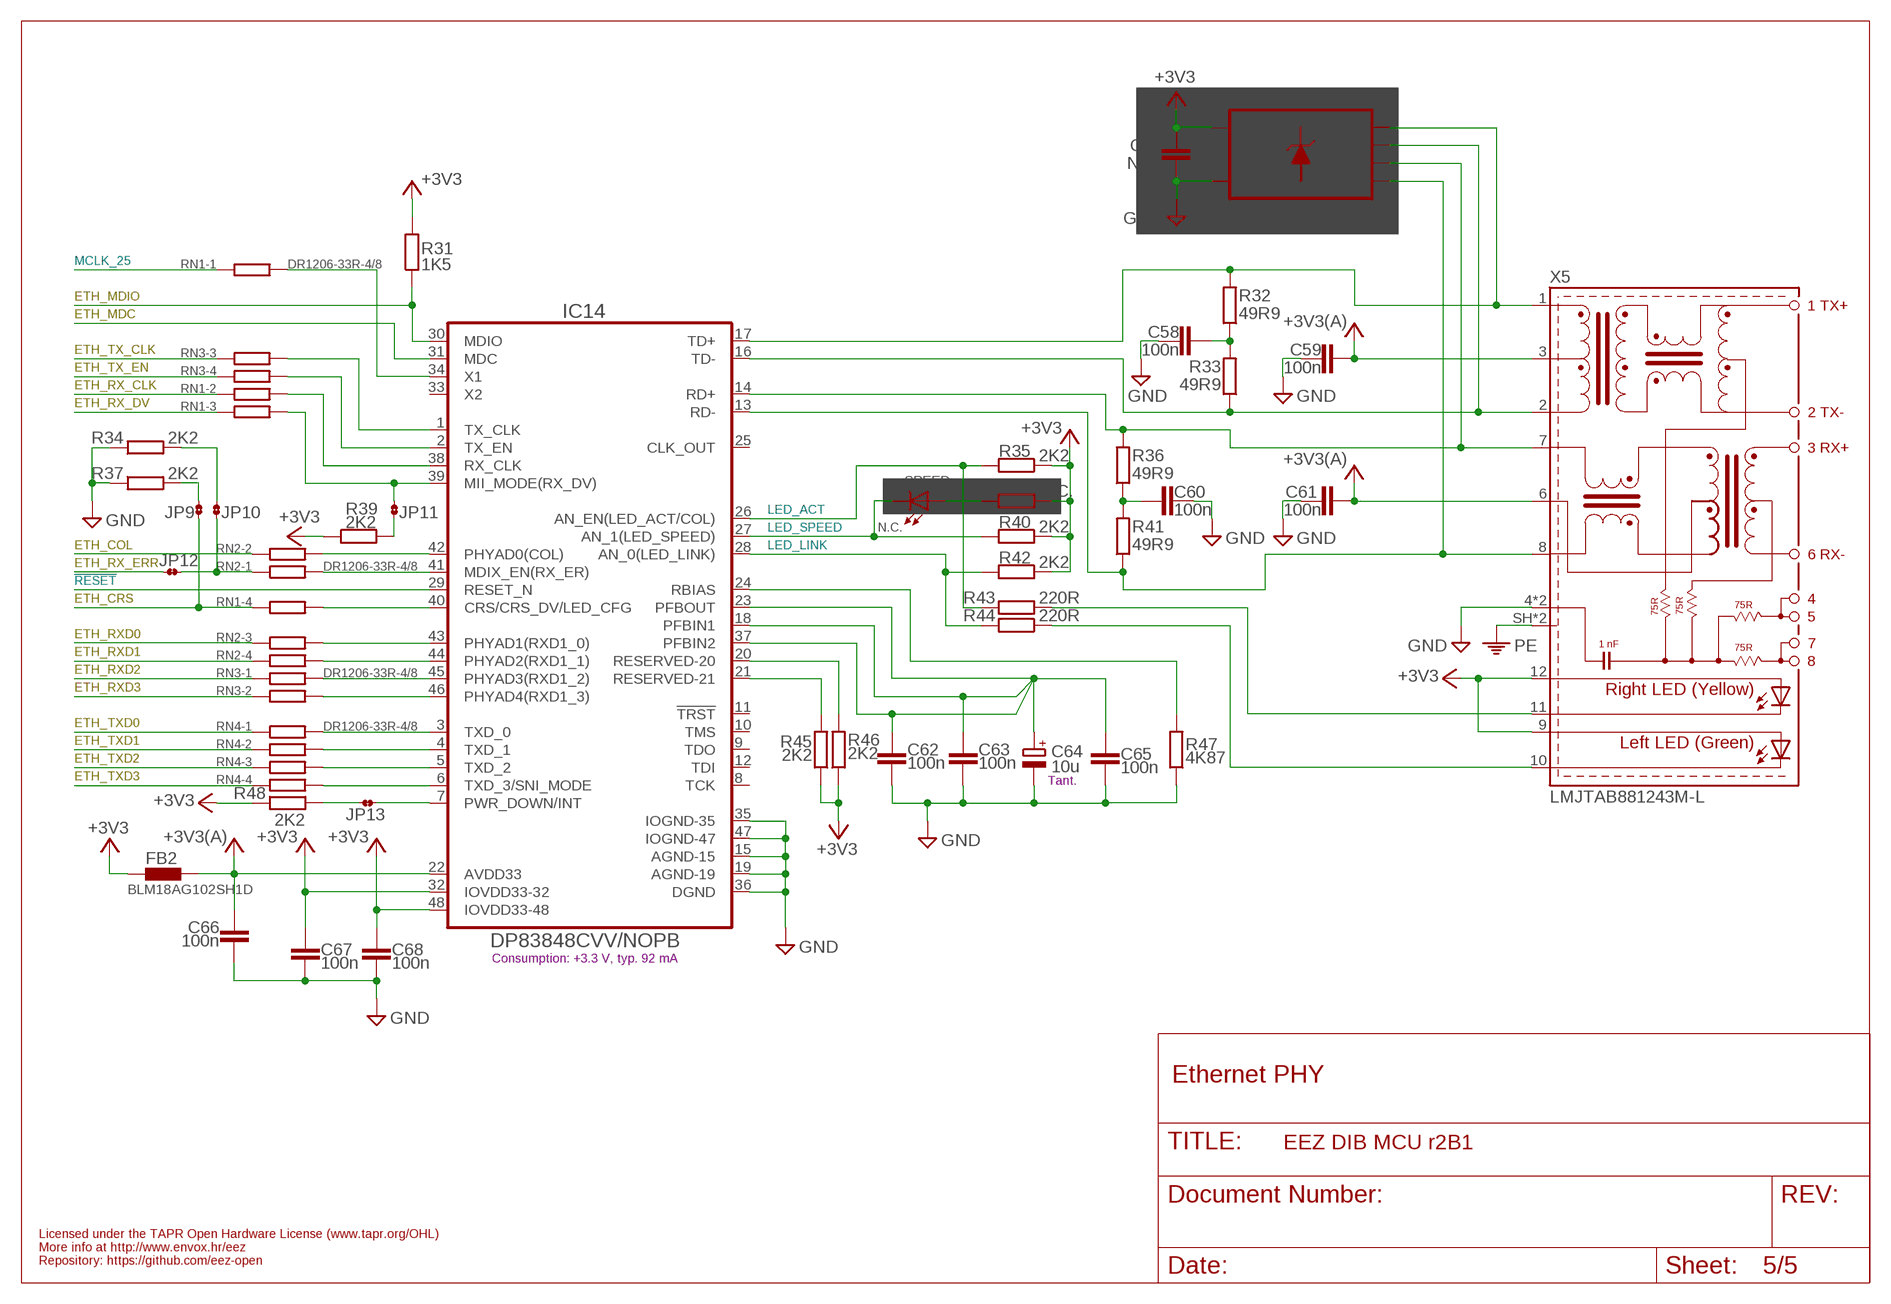
[diagram p4: schematic, sheet 5]

### Parts
C57  N.C.  C-EUC0603  [C0603]
C58  100n  C-EUC0603  [C0603]
C59  100n  C-EUC0603  [C0603]
C60  100n  C-EUC0603  [C0603]
C61  100n  C-EUC0603  [C0603]
C62  100n  C-EUC0603  [C0603]
C63  100n  C-EUC0603  [C0603]
C64  10u  ECAP1206  [EC1206]
C65  100n  C-EUC0603  [C0603]
C66  100n  C-EUC0603  [C0603]
C67  100n  C-EUC0603  [C0603]
C68  100n  C-EUC0603  [C0603]
FB2  BLM18AG102SH1D  FERRITE_BEAD0603  [BEAD0603]
IC13  N.C.  TPD4E001-DRL  [DRL6]
IC14  DP83848CVV/NOPB  [PT48]
JP9  JP2-CUT  [JP2-CUT]
JP10  JP2-CUT  [JP2-CUT]
JP11  JP2-CUT  [JP2-CUT]
JP12  JP2-NOCUT  [JP2-NOCUT]
JP13  JP2-NOCUT  [JP2-NOCUT]
R31  1K5  R-EU_R0805  [R0805]
R32  49R9  R-EU_R0805  [R0805]
R33  49R9  R-EU_R0805  [R0805]
R34  2K2  R-EU_R0805  [R0805]
R35  2K2  R-EU_R0805  [R0805]
R36  49R9  R-EU_R0805  [R0805]
R37  2K2  R-EU_R0805  [R0805]
R38  N.C.  R-EU_R0805  [R0805]
R39  2K2  R-EU_R0805  [R0805]
R40  2K2  R-EU_R0805  [R0805]
R41  49R9  R-EU_R0805  [R0805]
R42  2K2  R-EU_R0805  [R0805]
R43  220R  R-EU_R0805  [R0805]
R44  220R  R-EU_R0805  [R0805]
R45  2K2  R-EU_R0805  [R0805]
R46  2K2  R-EU_R0805  [R0805]
R47  4K87  R-EU_R0805  [R0805]
R48  2K2  R-EU_R0805  [R0805]
RN1  DR1206-33R-4/8  R_ARRAY4  [CAY16]
RN2  DR1206-33R-4/8  R_ARRAY4  [CAY16]
RN3  DR1206-33R-4/8  R_ARRAY4  [CAY16]
RN4  DR1206-33R-4/8  R_ARRAY4  [CAY16]
SPEED  N.C.  LED0805  [LED_0805]
X5  LMJTAB881243M-L  RJ45-TRAFO-LED  [RJ45-TRAFO-LED]

### Nets
!RESET: IC14.29(RESET_N) ; also sheet 1,2,3,4
+3V3: C57.1 C67.1 C68.1 FB2.P$1 IC13.6(VCC) IC14.32(IOVDD33-32) IC14.48(IOVDD33-48) R31.2 R35.1 R38.1 R39.1 R40.1 R42.1 R45.1 R46.1 R48.1 X5.9(GREEN-A) X5.12(YELLOW_A) ; also sheet 1,2,3,4
+3V3(A): C59.2 C61.2 C66.1 FB2.P$2 IC14.22(AVDD33) X5.3(CT) X5.6(CR)
ETH_COL: RN2.2 ; also sheet 2
ETH_CRS: JP9.1 RN1.4 ; also sheet 2
ETH_MDC: IC14.31(MDC) ; also sheet 2
ETH_MDIO: IC14.30(MDIO) R31.1 ; also sheet 2
ETH_RX_CLK: RN1.2 ; also sheet 2
ETH_RX_DV: RN1.3 ; also sheet 2
ETH_RX_ER: JP10.1 JP12.1 RN2.1
ETH_RX_ERR: JP12.2 ; also sheet 2
ETH_RXD0: RN2.3 ; also sheet 2
ETH_RXD1: RN2.4 ; also sheet 2
ETH_RXD2: RN3.1 ; also sheet 2
ETH_RXD3: RN3.2 ; also sheet 2
ETH_TX_CLK: RN3.3 ; also sheet 2
ETH_TX_EN: RN3.4 ; also sheet 2
ETH_TXD0: RN4.1 ; also sheet 2
ETH_TXD1: RN4.2 ; also sheet 2
ETH_TXD2: RN4.3 ; also sheet 2
ETH_TXD3: RN4.4 ; also sheet 2
GND [gnd]: C57.2 C58.2 C59.1 C60.2 C61.1 C62.2 C63.2 C64.- C65.2 C66.2 C67.2 C68.2 IC13.3(GND) IC14.15(AGND-15) IC14.19(AGND-19) IC14.35(IOGND-35) IC14.36(DGND) IC14.47(IOGND-47) R34.1 R37.1 R47.1 X5.4(GND) X5.5(GND) ; also sheet 1,2,3,4
LED_ACT: IC14.26(AN_EN(LED_ACT/COL)) R35.2 R43.2
LED_LINK: IC14.28(AN_0(LED_LINK)) R42.2 R44.2
LED_SPEED: IC14.27(AN_1(LED_SPEED)) R40.2 SPEED.C
MCLK_25: RN1.1 ; also sheet 2
N$1: IC14.1(TX_CLK) RN3.6
N$3: C58.1 R32.1 R33.2
N$8: R43.1 X5.11(YELLOW-C)
N$9: R44.1 X5.10(GREEN-C)
N$10: IC14.2(TX_EN) RN3.5
N$11: IC14.39(MII_MODE(RX_DV)) JP11.2 RN1.6
N$12: IC14.38(RX_CLK) RN1.7
N$15: IC14.3(TXD_0) RN4.8
N$17: IC14.4(TXD_1) RN4.7
N$21: IC14.5(TXD_2) RN4.6
N$22: IC14.34(X1) RN1.8
N$23: JP11.1 R39.2
N$25: JP9.2 R37.2
N$26: JP10.2 R34.2
N$27: IC14.7(PWR_DOWN/INT) JP13.2
N$28: JP13.1 R48.2
N$29: IC14.6(TXD_3/SNI_MODE) RN4.5
N$31: IC14.46(PHYAD4(RXD1_3)) RN3.7
N$32: IC14.45(PHYAD3(RXD1_2)) RN3.8
N$33: IC14.42(PHYAD0(COL)) RN2.7
N$34: IC14.44(PHYAD2(RXD1_1)) RN2.5
N$35: IC14.43(PHYAD1(RXD1_0)) RN2.6
N$36: IC14.41(MDIX_EN(RX_ER)) RN2.8
N$37: IC14.40(CRS/CRS_DV/LED_CFG) RN1.5
N$97: IC14.24(RBIAS) R47.2
N$98: IC14.21(RESERVED-21) R45.2
N$99: IC14.20(RESERVED-20) R46.2
N$101: R38.2 SPEED.A
N$102: C60.1 R36.1 R41.2
PE: X5.SH X5.SH2(SH) ; also sheet 1,4
PFBOUT: C62.1 C63.1 C64.+ C65.1 IC14.18(PFBIN1) IC14.23(PFBOUT) IC14.37(PFBIN2)
RD+: IC13.4(IO3) IC14.14(RD+) R36.2 X5.7(RD+)
RD-: IC13.5(IO4) IC14.13(RD-) R41.1 X5.8(RD-)
TD+: IC13.1(IO1) IC14.17(TD+) R32.2 X5.1(TD+)
TD-: IC13.2(IO2) IC14.16(TD-) R33.1 X5.2(TD-)
Unconnected: IC14.8(TCK) IC14.9(TDO) IC14.10(TMS) IC14.11(!TRST) IC14.12(TDI) IC14.25(CLK_OUT) IC14.33(X2)

### Notes on the sheet
- Tant.
- Consumption: +3.3 V, typ. 92 mA
- Ethernet PHY
- Licensed under the TAPR Open Hardware License (www.tapr.org/OHL)
- More info at http://www.envox.hr/eez
- Repository: https://github.com/eez-open

## Library data of the parts
B1 = EEZ_Lib1:CELL_BATTERY: HARWIN Battery holder for coin cell 20mm Farnell: 2115304
BOOT0 = EEZ_Lib1:JUMPER-2PIN
C1-C12 C14 C16-C21 C23-C48 C50-C63 C65-C68 = rcl:C-EU: CAPACITOR, European symbol
C13 C15 C22 C49 C64 = EEZ_Lib1:ECAP
D1 = MyLib6:DIODE
D2 = EEZ_Lib1:SCHOTTKY
FB1 FB2 = EEZ_Lib1:FERRITE_BEAD: FAIR-RITE - 2506033007Y3 - FERRITE BEAD, 0.04OHM, 3A, 0603 Farnell: 2112873
FM1 FM2 = EEZ_Lib1:FIDUCIAL: Fiducial mark for pick and place automation
IC1 IC5 IC10 IC11 IC13 = EEZ_Lib1:TPD4E001: Low-Capacitance 4-Channel ESD-Protection for High-Speed Data Interfaces
IC2 = EEZ_DIB:CD74HC4050: High-Speed CMOS Logic Hex Buffers, Non-Inverting; MANUFACTURER_PART_NUMBER: CD74HC4050PWR; VENDOR: Vendor
IC3 = EEZ_DIB:STM32F769IXT; COPYRIGHT: Copyright C 2016 Accelerated Designs. All rights reserved; MANUFACTURER_PART_NUMBER: stm32f769ixt; VENDOR: STMicroelectronics
IC4 = v-reg:LD117A?*: Low drop fixed and adjustable positive voltage regulators 1 A Source: http://www.st.com/stonline/products/literature/ds/7194/ld1117axx.pdf
IC6 = EEZ_Lib1:IS42S16400: 1 MBits x 16 Bits x 4 Banks (64-Mbit) Synchronous Dynamic RAM
IC7 = EEZ_Lib1:AT24CXX: I2C-Compatible (2-wire) Serial EEPROM
IC8 = EEZ_Lib1:TPS2051B: Current-Limited, Power-Distribution Switch (pos. enable input)
IC9 = EEZ_Lib1:TPS61169DCKR: 38-V High Current-Boost WLED Driver with PWM Control; MANUFACTURER: Texas Instruments; PARTNUMBER: TPS61169DCKR; REFDES: RefDes; TYPE: TYPE; VALUE: Value
IC12 = EEZ_Lib1:TSC2007: 12-Bit, Nanopower, 4-Wire Micro TOUCH SCREEN CONTROLLER with I2C Interface
IC14 = EEZ_Lib1:DP83848: DP83848C/I/VYB/YB PHYTER™ QFP Single Port 10/100 Mb/s Ethernet Physical Layer Transceiver
J1 = EEZ_Lib1:5033981892: SD Micro connector; push-push; SMT; gold plated
J2 = EEZ_Lib1:678038020: USB AB mini socket; SMT; PIN:5; horizontal; gold plated
JP1 JP2 JP12 JP13 SCL SDA = EEZ_Lib1:JP2-NOCUT
JP3 JP5 JP9-JP11 = EEZ_Lib1:JP2-CUT
JP4 JP6-JP8 = EEZ_Lib1:JP3-CUT
L1 = EEZ_Lib1:DE0403: Ferrocore SMD power coil 4.0 x 4.5 mm
LCD1 = EEZ_Lib1:RFE430Y-AIW-DNS: 40-pin socket for TFT LCD display with touchscreen
Q1 = transistor:*-NPN-: NPN Transistror BF959 corrected 2008.03.06
Q2 = EEZ_Lib1:2N7002: N-CHANNEL ENHANCEMENT MODE FIELD EFFECT TRANSISTOR; MPN: 2N7002-7-F; OC_FARNELL: 1713823; OC_NEWARK: 25R5679; PACKAGE: SOT-23-3; SUPPLIER: DIODES INC.
R1-R48 = rcl:R-EU_: RESISTOR, European symbol
RN1-RN4 = EEZ_Lib1:R_ARRAY4: 1206 four resistor array
SP1 = EEZ_Lib1:AI-1223-TWT: Audio indicator 12mm
SPEED VBUS = EEZ_Lib1:LED
SW1 = EEZ_switches:TL1100C: Tactile Switch 12 X 6.45MM Right angle
SW2 = EEZ_switches:ENCODER_SW
TP1 = EEZ_Lib1:PCB_TEST_TAB
X1 = EEZ_connectors:ZL263-40DG: Socket; pin strips; female; PIN:40; angled 90°; 2.54mm; THT; 2x20
X2 = EEZ_connectors:IDC-16PIN: 16-pin IDC socket
X3 = EEZ_connectors:MC1,5/5-G-3,5: Pluggable Terminal Blocks 5-pin 3.5mm pitch Through Hole Header
X4 = EEZ_connectors:22-23-2061: .100" (2.54mm) Center Header - 6 Pin; MF: MOLEX; MPN: 22-23-2061; OC_FARNELL: 1462922; OC_NEWARK: 27C1933
X5 = EEZ_Lib1:RJ45-TRAFO-LED: AMPHENOL LMJTAB881243M-L Socket; RJ45; PIN:8; shielded, with LED and trafo; TME: LMJTAB881243M-L
Y1 Y2 = EEZ_Lib1:XTAL
ZD1 = EEZ_Lib1:ZENER-DIODE

## Net classes
0 default: width 0.152 mm, drill 0.3 mm, clearance 0.203 mm
1 diff: width 0.229 mm, drill 0.3 mm, clearance 0.203 mm
2 gnd: width 0.152 mm, drill 0.3 mm, clearance 0.203 mm